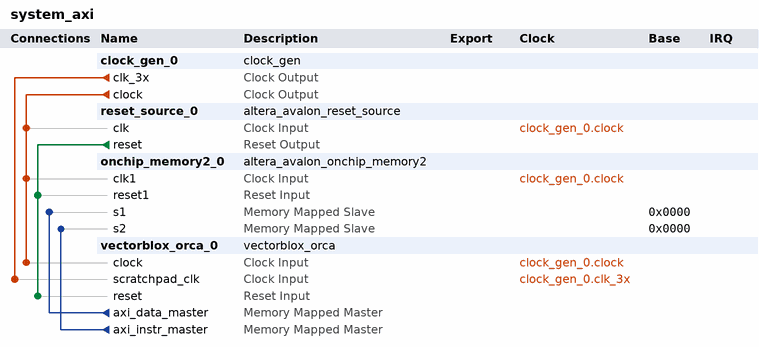
[diagram p0: system contents]
# Platform Designer (Qsys) system system_axi, Cyclone IV E Unknown
# Parameters at their usual value, and those the tool derives, are not listed.
package require -exact qsys 15.1
create_system system_axi
set_project_property DEVICE_FAMILY {Cyclone IV E}
set_project_property DEVICE Unknown

add_instance clock_gen_0 clock_gen 1.0
set_instance_parameter_value clock_gen_0 CLK_MHZ 1000

add_instance reset_source_0 altera_avalon_reset_source 15.1
set_instance_parameter_value reset_source_0 ASSERT_HIGH_RESET 1
set_instance_parameter_value reset_source_0 INITIAL_RESET_CYCLES 6

add_instance onchip_memory2_0 altera_avalon_onchip_memory2 15.1
set_instance_parameter_value onchip_memory2_0 dataWidth 32
set_instance_parameter_value onchip_memory2_0 dualPort true
set_instance_parameter_value onchip_memory2_0 initMemContent true
set_instance_parameter_value onchip_memory2_0 initializationFileName test.hex
set_instance_parameter_value onchip_memory2_0 memorySize 65536
set_instance_parameter_value onchip_memory2_0 singleClockOperation true
set_instance_parameter_value onchip_memory2_0 useNonDefaultInitFile true

add_instance vectorblox_orca_0 vectorblox_orca 1.0
set_instance_parameter_value vectorblox_orca_0 BRANCH_PREDICTION false
set_instance_parameter_value vectorblox_orca_0 BTB_SIZE 0
set_instance_parameter_value vectorblox_orca_0 BUS_TYPE Axi
set_instance_parameter_value vectorblox_orca_0 COUNTER_LENGTH 64
set_instance_parameter_value vectorblox_orca_0 DIVIDE_ENABLE 1
set_instance_parameter_value vectorblox_orca_0 ENABLE_EXCEPTIONS 1
set_instance_parameter_value vectorblox_orca_0 LVE_ENABLE 1
set_instance_parameter_value vectorblox_orca_0 MULTIPLY_ENABLE 1
set_instance_parameter_value vectorblox_orca_0 NUM_EXT_INTERRUPTS 2
set_instance_parameter_value vectorblox_orca_0 PIPELINE_STAGES 4
set_instance_parameter_value vectorblox_orca_0 PLIC_ENABLE 0
set_instance_parameter_value vectorblox_orca_0 REGISTER_SIZE 32
set_instance_parameter_value vectorblox_orca_0 RESET_VECTOR 512
set_instance_parameter_value vectorblox_orca_0 SCRATCHPAD_SIZE 1024
set_instance_parameter_value vectorblox_orca_0 SHIFTER_MAX_CYCLES 32

# connections
add_connection clock_gen_0.clk_3x vectorblox_orca_0.scratchpad_clk clock
add_connection clock_gen_0.clock onchip_memory2_0.clk1 clock
add_connection clock_gen_0.clock reset_source_0.clk clock
add_connection clock_gen_0.clock vectorblox_orca_0.clock clock
add_connection reset_source_0.reset onchip_memory2_0.reset1 reset
add_connection reset_source_0.reset vectorblox_orca_0.reset reset
add_connection vectorblox_orca_0.axi_data_master onchip_memory2_0.s1 avalon
set_connection_parameter_value vectorblox_orca_0.axi_data_master/onchip_memory2_0.s1 baseAddress 0x0000
add_connection vectorblox_orca_0.axi_instr_master onchip_memory2_0.s2 avalon
set_connection_parameter_value vectorblox_orca_0.axi_instr_master/onchip_memory2_0.s2 baseAddress 0x0000

set_interconnect_requirement {$system} qsys_mm.clockCrossingAdapter HANDSHAKE
set_interconnect_requirement {$system} qsys_mm.insertDefaultSlave FALSE
set_interconnect_requirement {$system} qsys_mm.maxAdditionalLatency 0

save_system system_axi.qsys
